# Altium schematic sheet IPMC_Control.SchDoc
size A3; Author: Marcelo Vicente; Organization: Univ. of Wisconsin-Madison; Address1: Madison, WI 53706; DocumentNumber: 4; SheetNumber: 4; SheetTotal: 5
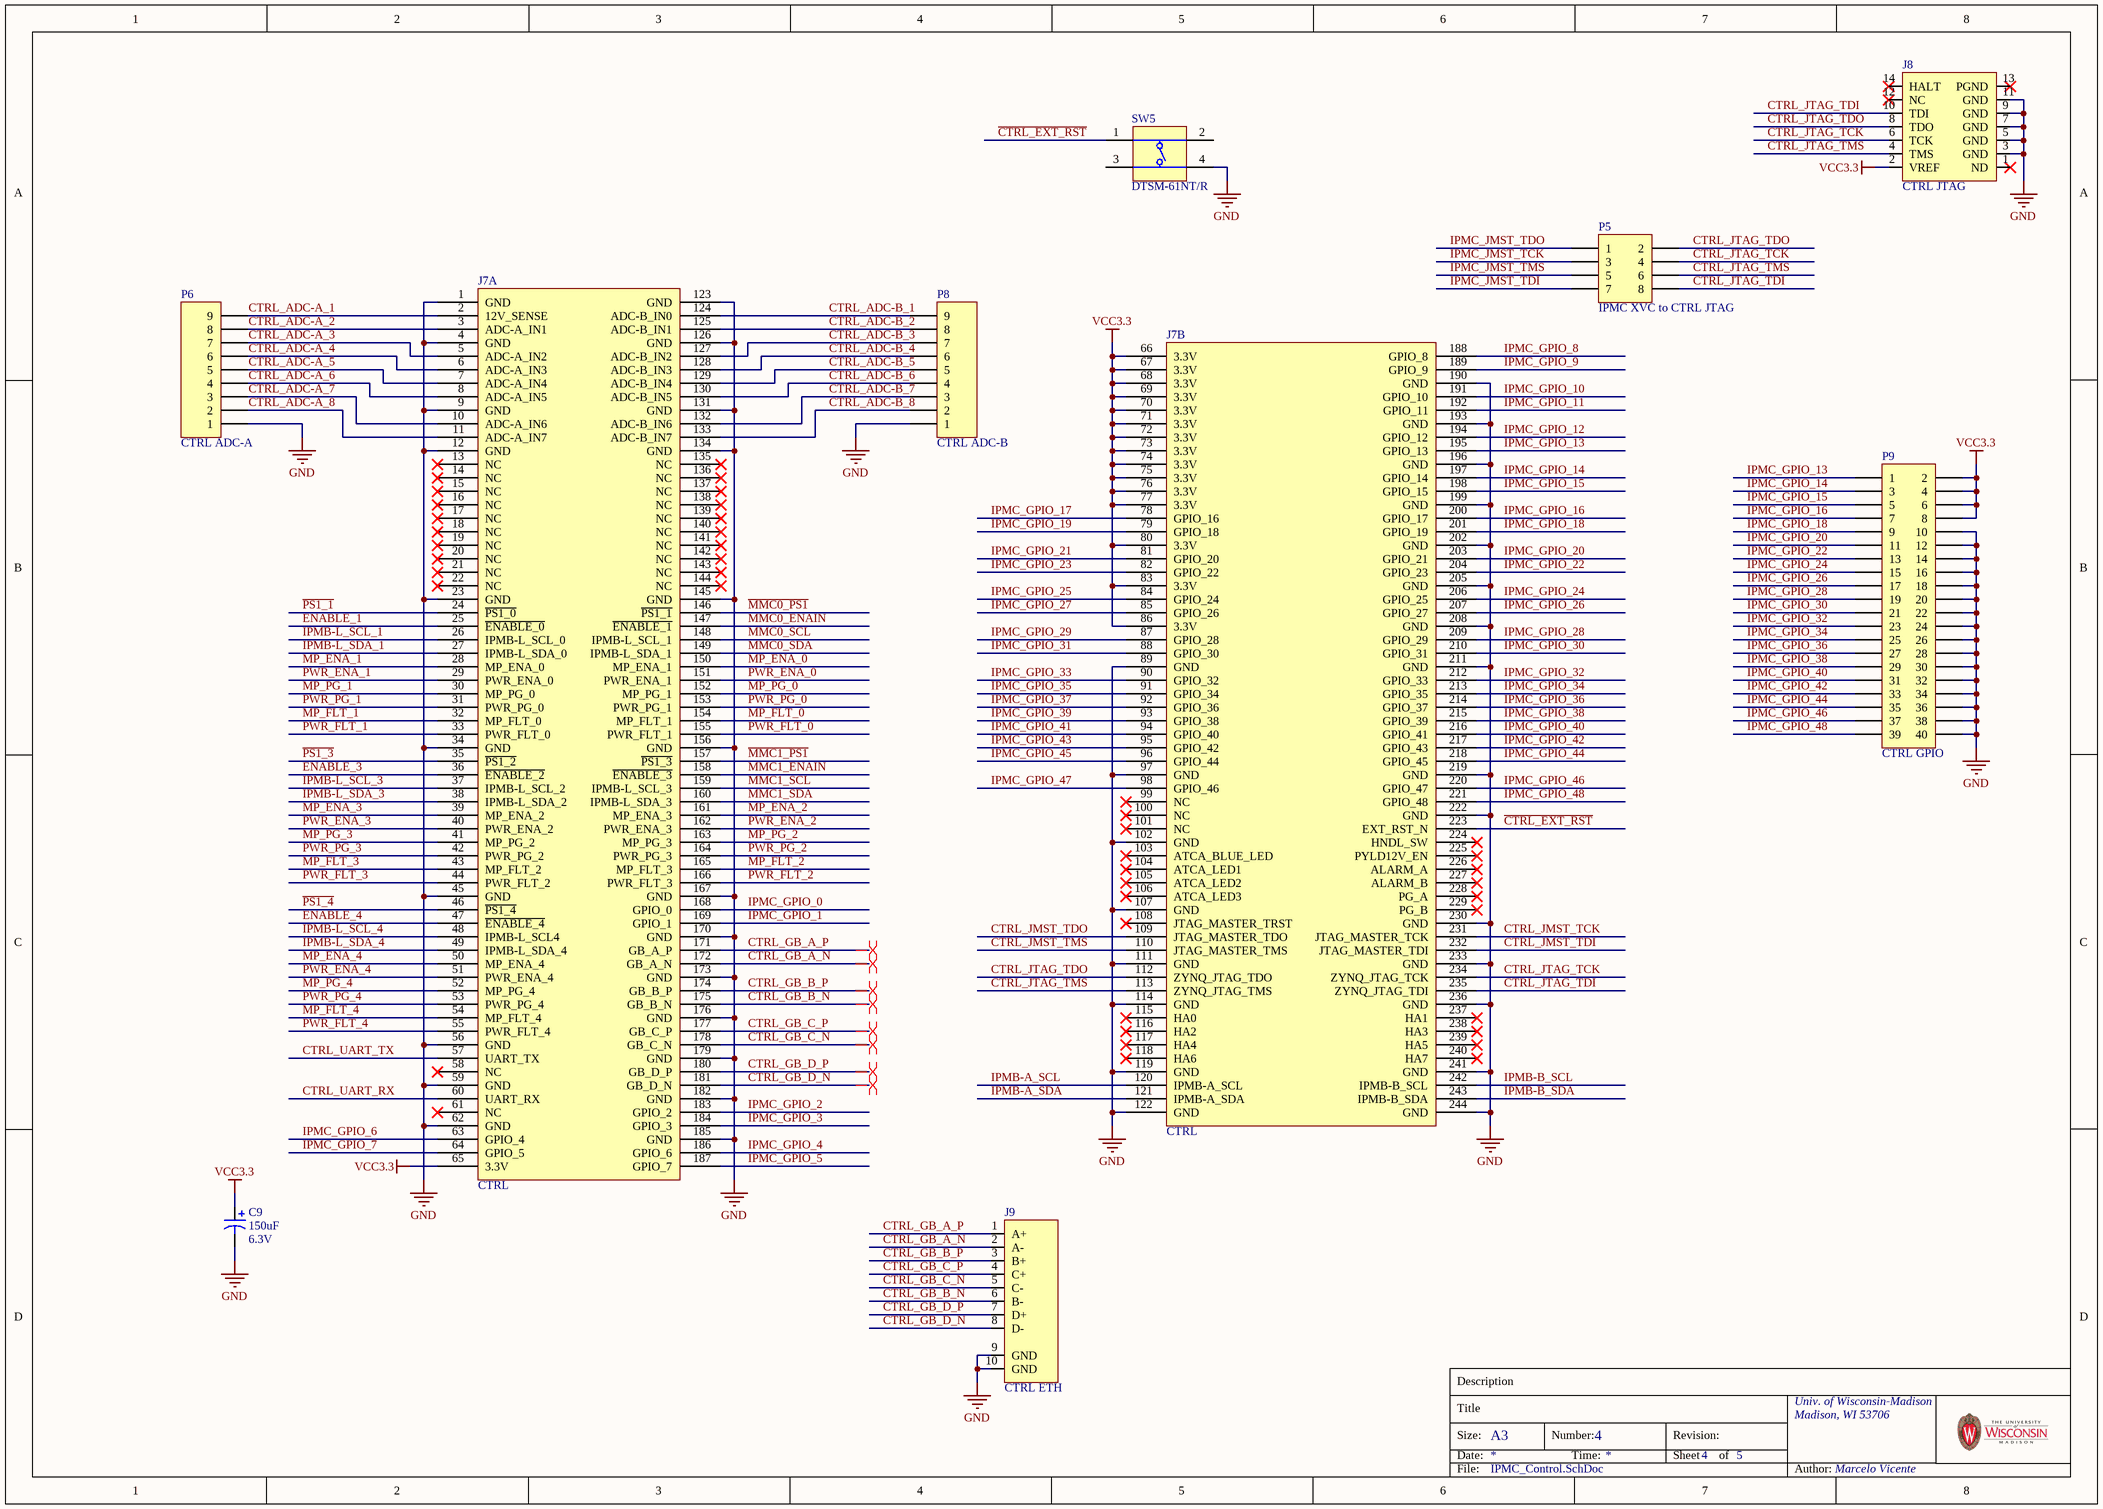
[diagram p0: IPMC_Control.SchDoc]

## Parts
C9  value 150uF  Rating: 6.3V  [VISH-293D-7343-31_V]  (hidden comment: ?)
J7  CTRL  [87782-3007]  (parts A,B of 2)
J8  CTRL JTAG  [87832-1420]
J9  CTRL ETH  [43202-8916]
P5  IPMC XVC to CTRL JTAG  [HEADER2X4]
P6  CTRL ADC-A  [HEADER1X9]
P8  CTRL ADC-B  [HEADER1X9]
P9  CTRL GPIO  [HEADER2X20]
SW5  DTSM-61NT/R  [DIPT-DTSM-6_V]

## Nets
GND: C9.2 J7.1(GND) J7.4(GND) J7.9(GND) J7.12(GND) J7.23(GND) J7.34(GND) J7.45(GND) J7.56(GND) J7.59(GND) J7.62(GND) J7.89(GND) J7.97(GND) J7.102(GND) J7.107(GND) J7.111(GND) J7.114(GND) J7.119(GND) J7.122(GND) J7.123(GND) J7.126(GND) J7.131(GND) J7.134(GND) J7.145(GND) J7.156(GND) J7.167(GND) J7.170(GND) J7.173(GND) J7.176(GND) J7.179(GND) J7.182(GND) J7.185(GND) J7.190(GND) J7.193(GND) J7.196(GND) J7.199(GND) J7.202(GND) J7.205(GND) J7.208(GND) J7.211(GND) J7.219(GND) J7.222(GND) J7.230(GND) J7.233(GND) J7.236(GND) J7.241(GND) J7.244(GND) J8.3(GND) J8.5(GND) J8.7(GND) J8.9(GND) J8.11(GND) J9.9(GND) J9.10(GND) P6.1 P8.1 P9.10 P9.12 P9.14 P9.16 P9.18 P9.20 P9.22 P9.24 P9.26 P9.28 P9.30 P9.32 P9.34 P9.36 P9.38 P9.40 SW5.4(T3)
VCC3.3: C9.1 J7.65(3.3V) J7.66(3.3V) J7.67(3.3V) J7.68(3.3V) J7.69(3.3V) J7.70(3.3V) J7.71(3.3V) J7.72(3.3V) J7.73(3.3V) J7.74(3.3V) J7.75(3.3V) J7.76(3.3V) J7.77(3.3V) J7.80(3.3V) J7.83(3.3V) J7.86(3.3V) J8.2(VREF) P9.2 P9.4 P9.6 P9.8
~{CTRL_EXT_RST}: J7.223(EXT_RST_N) SW5.1(T1)
~{ENABLE_1}: J7.25(~{ENABLE_0})
~{ENABLE_3}: J7.36(~{ENABLE_2})
~{ENABLE_4}: J7.47(~{ENABLE_4})
~{MMC0_ENAIN}: J7.147(~{ENABLE_1})
~{MMC0_PS1}: J7.146(~{PS1_1})
~{MMC1_ENAIN}: J7.158(~{ENABLE_3})
~{MMC1_PS1}: J7.157(~{PS1_3})
~{PS1_1}: J7.24(~{PS1_0})
~{PS1_3}: J7.35(~{PS1_2})
~{PS1_4}: J7.46(~{PS1_4})
CTRL_ADC-A_1: J7.2(12V_SENSE) P6.9
CTRL_ADC-A_2: J7.3(ADC-A_IN1) P6.8
CTRL_ADC-A_3: J7.5(ADC-A_IN2) P6.7
CTRL_ADC-A_4: J7.6(ADC-A_IN3) P6.6
CTRL_ADC-A_5: J7.7(ADC-A_IN4) P6.5
CTRL_ADC-A_6: J7.8(ADC-A_IN5) P6.4
CTRL_ADC-A_7: J7.10(ADC-A_IN6) P6.3
CTRL_ADC-A_8: J7.11(ADC-A_IN7) P6.2
CTRL_ADC-B_1: J7.124(ADC-B_IN0) P8.9
CTRL_ADC-B_2: J7.125(ADC-B_IN1) P8.8
CTRL_ADC-B_3: J7.127(ADC-B_IN2) P8.7
CTRL_ADC-B_4: J7.128(ADC-B_IN3) P8.6
CTRL_ADC-B_5: J7.129(ADC-B_IN4) P8.5
CTRL_ADC-B_6: J7.130(ADC-B_IN5) P8.4
CTRL_ADC-B_7: J7.132(ADC-B_IN6) P8.3
CTRL_ADC-B_8: J7.133(ADC-B_IN7) P8.2
CTRL_GB_A_N: J7.172(GB_A_N) J9.2(A-)
CTRL_GB_A_P: J7.171(GB_A_P) J9.1(A+)
CTRL_GB_B_N: J7.175(GB_B_N) J9.6(B-)
CTRL_GB_B_P: J7.174(GB_B_P) J9.3(B+)
CTRL_GB_C_N: J7.178(GB_C_N) J9.5(C-)
CTRL_GB_C_P: J7.177(GB_C_P) J9.4(C+)
CTRL_GB_D_N: J7.181(GB_D_N) J9.8(D-)
CTRL_GB_D_P: J7.180(GB_D_P) J9.7(D+)
CTRL_JMST_TCK: J7.231(JTAG_MASTER_TCK)
CTRL_JMST_TDI: J7.232(JTAG_MASTER_TDI)
CTRL_JMST_TDO: J7.109(JTAG_MASTER_TDO)
CTRL_JMST_TMS: J7.110(JTAG_MASTER_TMS)
CTRL_JTAG_TCK: J7.234(ZYNQ_JTAG_TCK) J8.6(TCK) P5.4
CTRL_JTAG_TDI: J7.235(ZYNQ_JTAG_TDI) J8.10(TDI) P5.8
CTRL_JTAG_TDO: J7.112(ZYNQ_JTAG_TDO) J8.8(TDO) P5.2
CTRL_JTAG_TMS: J7.113(ZYNQ_JTAG_TMS) J8.4(TMS) P5.6
CTRL_UART_RX: J7.60(UART_RX)
CTRL_UART_TX: J7.57(UART_TX)
IPMB-A_SCL: J7.120(IPMB-A_SCL)
IPMB-A_SDA: J7.121(IPMB-A_SDA)
IPMB-B_SCL: J7.242(IPMB-B_SCL)
IPMB-B_SDA: J7.243(IPMB-B_SDA)
IPMB-L_SCL_1: J7.26(IPMB-L_SCL_0)
IPMB-L_SCL_3: J7.37(IPMB-L_SCL_2)
IPMB-L_SCL_4: J7.48(IPMB-L_SCL4)
IPMB-L_SDA_1: J7.27(IPMB-L_SDA_0)
IPMB-L_SDA_3: J7.38(IPMB-L_SDA_2)
IPMB-L_SDA_4: J7.49(IPMB-L_SDA_4)
IPMC_GPIO_0: J7.168(GPIO_0)
IPMC_GPIO_1: J7.169(GPIO_1)
IPMC_GPIO_2: J7.183(GPIO_2)
IPMC_GPIO_3: J7.184(GPIO_3)
IPMC_GPIO_4: J7.186(GPIO_6)
IPMC_GPIO_5: J7.187(GPIO_7)
IPMC_GPIO_6: J7.63(GPIO_4)
IPMC_GPIO_7: J7.64(GPIO_5)
IPMC_GPIO_8: J7.188(GPIO_8)
IPMC_GPIO_9: J7.189(GPIO_9)
IPMC_GPIO_10: J7.191(GPIO_10)
IPMC_GPIO_11: J7.192(GPIO_11)
IPMC_GPIO_12: J7.194(GPIO_12)
IPMC_GPIO_13: J7.195(GPIO_13) P9.1
IPMC_GPIO_14: J7.197(GPIO_14) P9.3
IPMC_GPIO_15: J7.198(GPIO_15) P9.5
IPMC_GPIO_16: J7.200(GPIO_17) P9.7
IPMC_GPIO_17: J7.78(GPIO_16)
IPMC_GPIO_18: J7.201(GPIO_19) P9.9
IPMC_GPIO_19: J7.79(GPIO_18)
IPMC_GPIO_20: J7.203(GPIO_21) P9.11
IPMC_GPIO_21: J7.81(GPIO_20)
IPMC_GPIO_22: J7.204(GPIO_23) P9.13
IPMC_GPIO_23: J7.82(GPIO_22)
IPMC_GPIO_24: J7.206(GPIO_25) P9.15
IPMC_GPIO_25: J7.84(GPIO_24)
IPMC_GPIO_26: J7.207(GPIO_27) P9.17
IPMC_GPIO_27: J7.85(GPIO_26)
IPMC_GPIO_28: J7.209(GPIO_29) P9.19
IPMC_GPIO_29: J7.87(GPIO_28)
IPMC_GPIO_30: J7.210(GPIO_31) P9.21
IPMC_GPIO_31: J7.88(GPIO_30)
IPMC_GPIO_32: J7.212(GPIO_33) P9.23
IPMC_GPIO_33: J7.90(GPIO_32)
IPMC_GPIO_34: J7.213(GPIO_35) P9.25
IPMC_GPIO_35: J7.91(GPIO_34)
IPMC_GPIO_36: J7.214(GPIO_37) P9.27
IPMC_GPIO_37: J7.92(GPIO_36)
IPMC_GPIO_38: J7.215(GPIO_39) P9.29
IPMC_GPIO_39: J7.93(GPIO_38)
IPMC_GPIO_40: J7.216(GPIO_41) P9.31
IPMC_GPIO_41: J7.94(GPIO_40)
IPMC_GPIO_42: J7.217(GPIO_43) P9.33
IPMC_GPIO_43: J7.95(GPIO_42)
IPMC_GPIO_44: J7.218(GPIO_45) P9.35
IPMC_GPIO_45: J7.96(GPIO_44)
IPMC_GPIO_46: J7.220(GPIO_47) P9.37
IPMC_GPIO_47: J7.98(GPIO_46)
IPMC_GPIO_48: J7.221(GPIO_48) P9.39
IPMC_JMST_TCK: P5.3
IPMC_JMST_TDI: P5.7
IPMC_JMST_TDO: P5.1
IPMC_JMST_TMS: P5.5
MMC0_SCL: J7.148(IPMB-L_SCL_1)
MMC0_SDA: J7.149(IPMB-L_SDA_1)
MMC1_SCL: J7.159(IPMB-L_SCL_3)
MMC1_SDA: J7.160(IPMB-L_SDA_3)
MP_ENA_0: J7.150(MP_ENA_1)
MP_ENA_1: J7.28(MP_ENA_0)
MP_ENA_2: J7.161(MP_ENA_3)
MP_ENA_3: J7.39(MP_ENA_2)
MP_ENA_4: J7.50(MP_ENA_4)
MP_FLT_0: J7.154(MP_FLT_1)
MP_FLT_1: J7.32(MP_FLT_0)
MP_FLT_2: J7.165(MP_FLT_3)
MP_FLT_3: J7.43(MP_FLT_2)
MP_FLT_4: J7.54(MP_FLT_4)
MP_PG_0: J7.152(MP_PG_1)
MP_PG_1: J7.30(MP_PG_0)
MP_PG_2: J7.163(MP_PG_3)
MP_PG_3: J7.41(MP_PG_2)
MP_PG_4: J7.52(MP_PG_4)
PWR_ENA_0: J7.151(PWR_ENA_1)
PWR_ENA_1: J7.29(PWR_ENA_0)
PWR_ENA_2: J7.162(PWR_ENA_3)
PWR_ENA_3: J7.40(PWR_ENA_2)
PWR_ENA_4: J7.51(PWR_ENA_4)
PWR_FLT_0: J7.155(PWR_FLT_1)
PWR_FLT_1: J7.33(PWR_FLT_0)
PWR_FLT_2: J7.166(PWR_FLT_3)
PWR_FLT_3: J7.44(PWR_FLT_2)
PWR_FLT_4: J7.55(PWR_FLT_4)
PWR_PG_0: J7.153(PWR_PG_1)
PWR_PG_1: J7.31(PWR_PG_0)
PWR_PG_2: J7.164(PWR_PG_3)
PWR_PG_3: J7.42(PWR_PG_2)
PWR_PG_4: J7.53(PWR_PG_4)

Not connected (* = marked no-connect by the designer): J7 13(NC)* 14(NC)* 15(NC)* 16(NC)* 17(NC)* 18(NC)* 19(NC)* 20(NC)* 21(NC)* 22(NC)* 58(NC)* 61(NC)* 99(NC)* 100(NC)* 101(NC)* 103(ATCA_BLUE_LED)* 104(ATCA_LED1)* 105(ATCA_LED2)* 106(ATCA_LED3)* 108(JTAG_MASTER_TRST)* 115(HA0)* 116(HA2)* 117(HA4)* 118(HA6)* 135(NC)* 136(NC)* 137(NC)* 138(NC)* 139(NC)* 140(NC)* 141(NC)* 142(NC)* 143(NC)* 144(NC)* 224(HNDL_SW)* 225(PYLD12V_EN)* 226(ALARM_A)* 227(ALARM_B)* 228(PG_A)* 229(PG_B)* 237(HA1)* 238(HA3)* 239(HA5)* 240(HA7)*; J8 1(ND)* 12(NC)* 13(PGND)* 14(HALT)*; SW5 2(T2) 3(T3)

## Layout directives
differential pair: CTRL_GB_A_N, CTRL_GB_A_P, CTRL_GB_B_N, CTRL_GB_B_P, CTRL_GB_C_N, CTRL_GB_C_P, CTRL_GB_D_N, CTRL_GB_D_P

## Notes on the sheet
- Description
- Title
- Size:
- Date:
- A3
- Number:
- Time:
- Revision:
- Sheet
- of
- File:
- Author:

## Library data of the parts
C9 = Cap Pol3: Polarized Capacitor (Surface Mount); Mfg. Part No.: A700X157M006ATE015; INVKEY: CP7343-150uF-6.3V-ESR15-20%; Mfgr: Kemet
J7 = IPMC: Molex 87782-3007; Note: Compatible with Molex 87782-3003, 87782-3005, 87782-3007 and 87782-3009; INVKEY: ?; Mfg. Part No.: 87782-3007; Mfgr: Molex
J8 = Xilinx JTAG Header: Molex 87832-1420; INVKEY: CO-PIN-HDR-2X7SS-2MM; Mfg. Part No.: 87832-1420; Mfgr: Molex
J9 = Ethernet Jack: RJ45 Ethernet Jack; INVKEY: CO-43202-8916; Mfgr: Molex; Mfg. Part No.: 43202-8916
P5 = Header 4X2: Header, 4-Pin, Dual row; INVKEY: ?; Mfg. Part No.: ?; Mfgr: ?
P6 P8 = Header 9: Header, 9-Pin; Note: Do not assemble; INVKEY: ?; Mfg. Part No.: ?; Mfgr: ?
P9 = Header 20X2: Header, 20-Pin, Dual row; Note: Do not assemble; INVKEY: ?; Mfg. Part No.: ?; Mfgr: ?
SW5 = CMP-0306-00001-1: Switch, SPNO Push Button SMD; INVKEY: ?; Mfg. Part No.: ?; Mfgr: ?